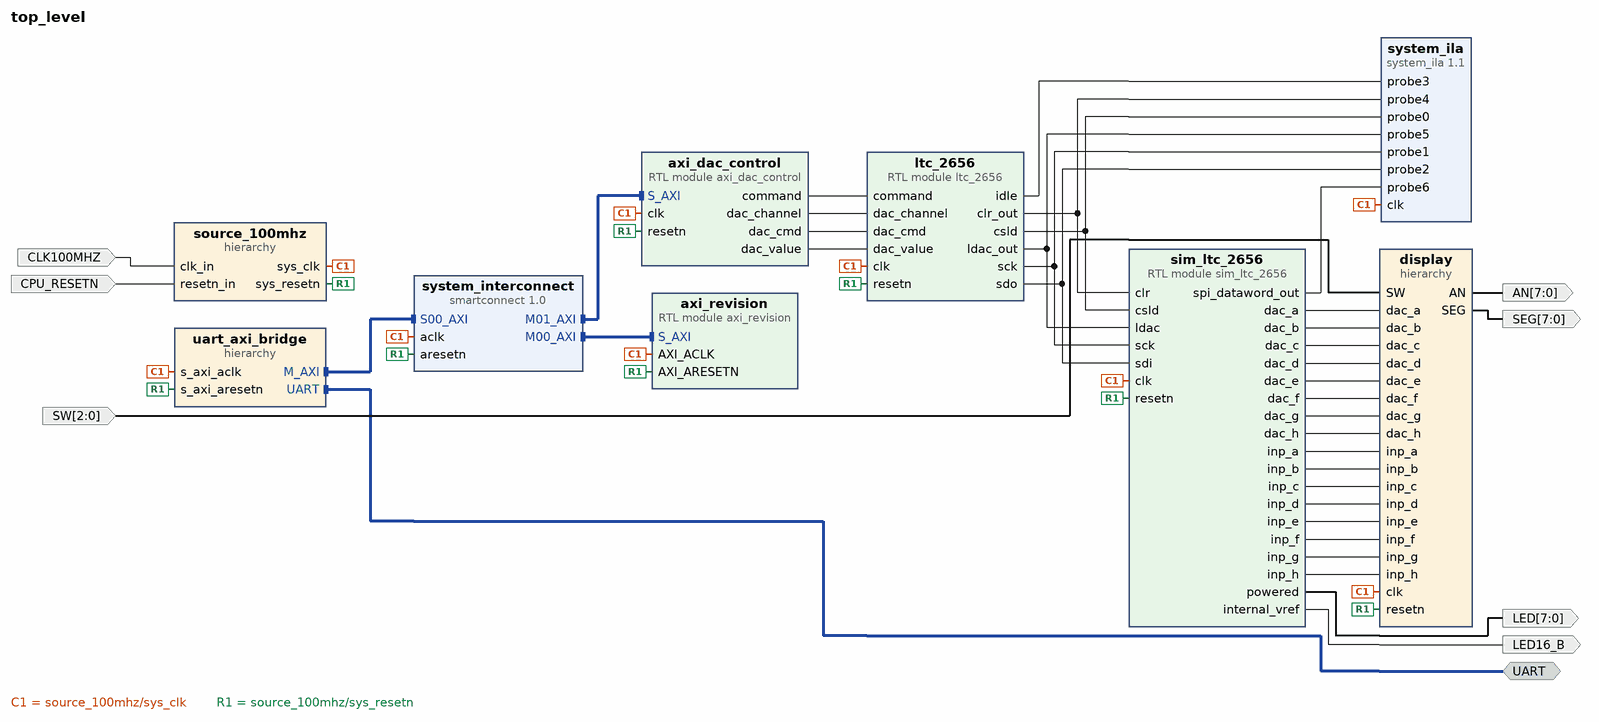
[diagram p0: block diagram of the top level]
# Vivado block design top_level, xc7a100tcsg324-1, Vivado 2021.1
create_bd_design top_level

create_bd_intf_port -mode Master -vlnv xilinx.com:interface:uart_rtl:1.0 UART
create_bd_port -dir I -type clk CLK100MHZ
create_bd_port -dir I -type rst CPU_RESETN
create_bd_port -dir O -from 7 -to 0 LED
create_bd_port -dir I -from 2 -to 0 SW
create_bd_port -dir O -from 7 -to 0 AN
create_bd_port -dir O -from 7 -to 0 SEG
create_bd_port -dir O LED16_B

create_bd_cell -type hier source_100mhz
create_bd_cell -type hier uart_axi_bridge
create_bd_cell -type ip -vlnv xilinx.com:ip:smartconnect:1.0 system_interconnect
set_property -dict {CONFIG.NUM_MI 2 CONFIG.NUM_SI 1} [get_bd_cells system_interconnect]
create_bd_cell -type ip -vlnv xilinx.com:ip:system_ila:1.1 system_ila
set_property -dict {CONFIG.C_MON_TYPE NATIVE CONFIG.C_NUM_OF_PROBES 7} [get_bd_cells system_ila]
create_bd_cell -type module -reference sim_ltc_2656 sim_ltc_2656
set_property -dict {CONFIG.UNPOWERED_DAC_VALUE 0xDEAD} [get_bd_cells sim_ltc_2656]
create_bd_cell -type module -reference axi_revision axi_revision
create_bd_cell -type hier display
create_bd_cell -type module -reference axi_dac_control axi_dac_control
create_bd_cell -type module -reference ltc_2656 ltc_2656

# ---- hierarchy /source_100mhz ----
current_bd_instance /source_100mhz
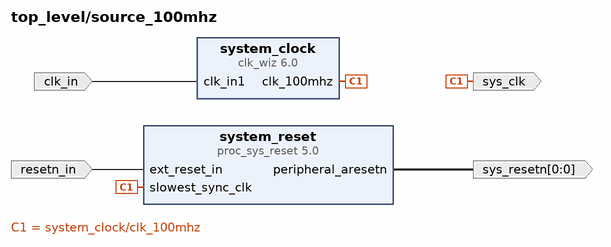
[diagram p1: block diagram inside /source_100mhz]
create_bd_pin -dir I -type clk clk_in
create_bd_pin -dir I -type rst resetn_in
create_bd_pin -dir O -type clk sys_clk
create_bd_pin -dir O -from 0 -to 0 sys_resetn

create_bd_cell -type ip -vlnv xilinx.com:ip:clk_wiz:6.0 system_clock
set_property -dict {CONFIG.CLK_OUT1_PORT clk_100mhz CONFIG.USE_LOCKED false CONFIG.USE_RESET false} [get_bd_cells system_clock]
create_bd_cell -type ip -vlnv xilinx.com:ip:proc_sys_reset:5.0 system_reset

# ---- hierarchy /uart_axi_bridge ----
current_bd_instance /uart_axi_bridge
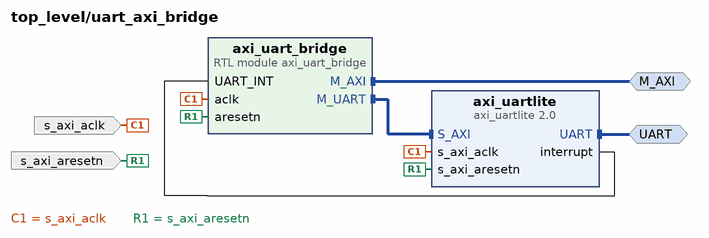
[diagram p2: block diagram inside /uart_axi_bridge]
create_bd_intf_pin -mode Master -vlnv xilinx.com:interface:uart_rtl:1.0 UART
create_bd_intf_pin -mode Master -vlnv xilinx.com:interface:aximm_rtl:1.0 M_AXI
create_bd_pin -dir I -type clk s_axi_aclk
create_bd_pin -dir I -type rst s_axi_aresetn

create_bd_cell -type module -reference axi_uart_bridge axi_uart_bridge
create_bd_cell -type ip -vlnv xilinx.com:ip:axi_uartlite:2.0 axi_uartlite
set_property -dict {CONFIG.C_BAUDRATE 115200} [get_bd_cells axi_uartlite]

# ---- hierarchy /display ----
current_bd_instance /display
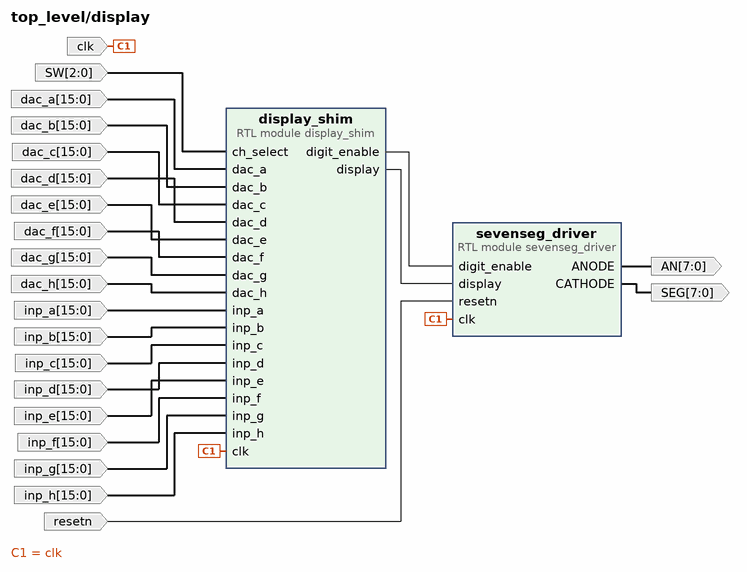
[diagram p3: block diagram inside /display]
create_bd_pin -dir I -type clk clk
create_bd_pin -dir I -from 15 -to 0 dac_a
create_bd_pin -dir I -from 15 -to 0 dac_b
create_bd_pin -dir I -from 15 -to 0 dac_c
create_bd_pin -dir I -from 15 -to 0 dac_d
create_bd_pin -dir I -from 15 -to 0 dac_e
create_bd_pin -dir I -from 15 -to 0 dac_f
create_bd_pin -dir I -from 15 -to 0 dac_g
create_bd_pin -dir I -from 15 -to 0 dac_h
create_bd_pin -dir I -from 15 -to 0 inp_a
create_bd_pin -dir I -from 15 -to 0 inp_b
create_bd_pin -dir I -from 15 -to 0 inp_c
create_bd_pin -dir I -from 15 -to 0 inp_d
create_bd_pin -dir I -from 15 -to 0 inp_e
create_bd_pin -dir I -from 15 -to 0 inp_f
create_bd_pin -dir I -from 15 -to 0 inp_g
create_bd_pin -dir I -from 15 -to 0 inp_h
create_bd_pin -dir I -from 2 -to 0 SW
create_bd_pin -dir I -type rst resetn
create_bd_pin -dir O -from 7 -to 0 AN
create_bd_pin -dir O -from 7 -to 0 SEG

create_bd_cell -type module -reference display_shim display_shim
create_bd_cell -type module -reference sevenseg_driver sevenseg_driver

# ---- connections ----

current_bd_instance /source_100mhz
connect_bd_net -net clk_in1_0_1 [get_bd_pins clk_in] [get_bd_pins system_clock/clk_in1]
connect_bd_net -net ext_reset_in_0_1 [get_bd_pins resetn_in] [get_bd_pins system_reset/ext_reset_in]
connect_bd_net [get_bd_pins system_clock/clk_100mhz] [get_bd_pins sys_clk] [get_bd_pins system_reset/slowest_sync_clk]
connect_bd_net [get_bd_pins system_reset/peripheral_aresetn] [get_bd_pins sys_resetn]

current_bd_instance /uart_axi_bridge
connect_bd_intf_net [get_bd_intf_pins M_AXI] [get_bd_intf_pins axi_uart_bridge/M_AXI]
connect_bd_intf_net [get_bd_intf_pins axi_uart_bridge/M_UART] [get_bd_intf_pins axi_uartlite/S_AXI]
connect_bd_intf_net [get_bd_intf_pins UART] [get_bd_intf_pins axi_uartlite/UART]
connect_bd_net [get_bd_pins axi_uartlite/interrupt] [get_bd_pins axi_uart_bridge/UART_INT]
connect_bd_net -net source_100mhz_sys_clk [get_bd_pins s_axi_aclk] [get_bd_pins axi_uartlite/s_axi_aclk] [get_bd_pins axi_uart_bridge/aclk]
connect_bd_net -net source_100mhz_sys_resetn [get_bd_pins s_axi_aresetn] \
  [get_bd_pins axi_uartlite/s_axi_aresetn] [get_bd_pins axi_uart_bridge/aresetn]

current_bd_instance /display
connect_bd_net -net ch_select_0_1 [get_bd_pins SW] [get_bd_pins display_shim/ch_select]
connect_bd_net [get_bd_pins display_shim/digit_enable] [get_bd_pins sevenseg_driver/digit_enable]
connect_bd_net [get_bd_pins display_shim/display] [get_bd_pins sevenseg_driver/display]
connect_bd_net [get_bd_pins sevenseg_driver/ANODE] [get_bd_pins AN]
connect_bd_net [get_bd_pins sevenseg_driver/CATHODE] [get_bd_pins SEG]
connect_bd_net -net sim_ltc_2656_dac_a [get_bd_pins dac_a] [get_bd_pins display_shim/dac_a]
connect_bd_net -net sim_ltc_2656_dac_b [get_bd_pins dac_b] [get_bd_pins display_shim/dac_b]
connect_bd_net -net sim_ltc_2656_dac_c [get_bd_pins dac_c] [get_bd_pins display_shim/dac_c]
connect_bd_net -net sim_ltc_2656_dac_d [get_bd_pins dac_d] [get_bd_pins display_shim/dac_d]
connect_bd_net -net sim_ltc_2656_dac_e [get_bd_pins dac_e] [get_bd_pins display_shim/dac_e]
connect_bd_net -net sim_ltc_2656_dac_f [get_bd_pins dac_f] [get_bd_pins display_shim/dac_f]
connect_bd_net -net sim_ltc_2656_dac_g [get_bd_pins dac_g] [get_bd_pins display_shim/dac_g]
connect_bd_net -net sim_ltc_2656_dac_h [get_bd_pins dac_h] [get_bd_pins display_shim/dac_h]
connect_bd_net -net sim_ltc_2656_inp_a [get_bd_pins inp_a] [get_bd_pins display_shim/inp_a]
connect_bd_net -net sim_ltc_2656_inp_b [get_bd_pins inp_b] [get_bd_pins display_shim/inp_b]
connect_bd_net -net sim_ltc_2656_inp_c [get_bd_pins inp_c] [get_bd_pins display_shim/inp_c]
connect_bd_net -net sim_ltc_2656_inp_d [get_bd_pins inp_d] [get_bd_pins display_shim/inp_d]
connect_bd_net -net sim_ltc_2656_inp_e [get_bd_pins inp_e] [get_bd_pins display_shim/inp_e]
connect_bd_net -net sim_ltc_2656_inp_f [get_bd_pins inp_f] [get_bd_pins display_shim/inp_f]
connect_bd_net -net sim_ltc_2656_inp_g [get_bd_pins inp_g] [get_bd_pins display_shim/inp_g]
connect_bd_net -net sim_ltc_2656_inp_h [get_bd_pins inp_h] [get_bd_pins display_shim/inp_h]
connect_bd_net -net source_100mhz_sys_clk [get_bd_pins clk] [get_bd_pins sevenseg_driver/clk] [get_bd_pins display_shim/clk]
connect_bd_net -net source_100mhz_sys_resetn [get_bd_pins resetn] [get_bd_pins sevenseg_driver/resetn]

current_bd_instance /
connect_bd_intf_net -intf_net axi_uartlite_UART [get_bd_intf_ports UART] [get_bd_intf_pins uart_axi_bridge/UART]
connect_bd_intf_net [get_bd_intf_pins system_interconnect/M00_AXI] [get_bd_intf_pins axi_revision/S_AXI]
connect_bd_intf_net [get_bd_intf_pins axi_dac_control/S_AXI] [get_bd_intf_pins system_interconnect/M01_AXI]
connect_bd_intf_net [get_bd_intf_pins uart_axi_bridge/M_AXI] [get_bd_intf_pins system_interconnect/S00_AXI]
connect_bd_net [get_bd_pins axi_dac_control/command] [get_bd_pins ltc_2656/command]
connect_bd_net [get_bd_pins axi_dac_control/dac_channel] [get_bd_pins ltc_2656/dac_channel]
connect_bd_net [get_bd_pins axi_dac_control/dac_cmd] [get_bd_pins ltc_2656/dac_cmd]
connect_bd_net [get_bd_pins axi_dac_control/dac_value] [get_bd_pins ltc_2656/dac_value]
connect_bd_net -net ch_select_0_1 [get_bd_ports SW] [get_bd_pins display/SW]
connect_bd_net -net clk_in1_0_1 [get_bd_ports CLK100MHZ] [get_bd_pins source_100mhz/clk_in]
connect_bd_net -net ext_reset_in_0_1 [get_bd_ports CPU_RESETN] [get_bd_pins source_100mhz/resetn_in]
connect_bd_net [get_bd_pins ltc_2656/clr_out] [get_bd_pins system_ila/probe4] [get_bd_pins sim_ltc_2656/clr]
connect_bd_net [get_bd_pins ltc_2656/csld] [get_bd_pins system_ila/probe0] [get_bd_pins sim_ltc_2656/csld]
connect_bd_net [get_bd_pins ltc_2656/idle] [get_bd_pins system_ila/probe3]
connect_bd_net [get_bd_pins ltc_2656/ldac_out] [get_bd_pins system_ila/probe5] [get_bd_pins sim_ltc_2656/ldac]
connect_bd_net [get_bd_pins ltc_2656/sck] [get_bd_pins system_ila/probe1] [get_bd_pins sim_ltc_2656/sck]
connect_bd_net [get_bd_pins ltc_2656/sdo] [get_bd_pins system_ila/probe2] [get_bd_pins sim_ltc_2656/sdi]
connect_bd_net -net sevenseg_driver_ANODE [get_bd_pins display/AN] [get_bd_ports AN]
connect_bd_net -net sevenseg_driver_CATHODE [get_bd_pins display/SEG] [get_bd_ports SEG]
connect_bd_net [get_bd_pins sim_ltc_2656/dac_a] [get_bd_pins display/dac_a]
connect_bd_net [get_bd_pins sim_ltc_2656/dac_b] [get_bd_pins display/dac_b]
connect_bd_net [get_bd_pins sim_ltc_2656/dac_c] [get_bd_pins display/dac_c]
connect_bd_net [get_bd_pins sim_ltc_2656/dac_d] [get_bd_pins display/dac_d]
connect_bd_net [get_bd_pins sim_ltc_2656/dac_e] [get_bd_pins display/dac_e]
connect_bd_net [get_bd_pins sim_ltc_2656/dac_f] [get_bd_pins display/dac_f]
connect_bd_net [get_bd_pins sim_ltc_2656/dac_g] [get_bd_pins display/dac_g]
connect_bd_net [get_bd_pins sim_ltc_2656/dac_h] [get_bd_pins display/dac_h]
connect_bd_net [get_bd_pins sim_ltc_2656/inp_a] [get_bd_pins display/inp_a]
connect_bd_net [get_bd_pins sim_ltc_2656/inp_b] [get_bd_pins display/inp_b]
connect_bd_net [get_bd_pins sim_ltc_2656/inp_c] [get_bd_pins display/inp_c]
connect_bd_net [get_bd_pins sim_ltc_2656/inp_d] [get_bd_pins display/inp_d]
connect_bd_net [get_bd_pins sim_ltc_2656/inp_e] [get_bd_pins display/inp_e]
connect_bd_net [get_bd_pins sim_ltc_2656/inp_f] [get_bd_pins display/inp_f]
connect_bd_net [get_bd_pins sim_ltc_2656/inp_g] [get_bd_pins display/inp_g]
connect_bd_net [get_bd_pins sim_ltc_2656/inp_h] [get_bd_pins display/inp_h]
connect_bd_net [get_bd_pins sim_ltc_2656/internal_vref] [get_bd_ports LED16_B]
connect_bd_net [get_bd_pins sim_ltc_2656/powered] [get_bd_ports LED]
connect_bd_net [get_bd_pins sim_ltc_2656/spi_dataword_out] [get_bd_pins system_ila/probe6]
connect_bd_net [get_bd_pins source_100mhz/sys_clk] \
  [get_bd_pins uart_axi_bridge/s_axi_aclk] [get_bd_pins system_interconnect/aclk] [get_bd_pins system_ila/clk] \
  [get_bd_pins sim_ltc_2656/clk] [get_bd_pins axi_revision/AXI_ACLK] [get_bd_pins display/clk] \
  [get_bd_pins axi_dac_control/clk] [get_bd_pins ltc_2656/clk]
connect_bd_net [get_bd_pins source_100mhz/sys_resetn] \
  [get_bd_pins uart_axi_bridge/s_axi_aresetn] [get_bd_pins system_interconnect/aresetn] [get_bd_pins sim_ltc_2656/resetn] \
  [get_bd_pins axi_revision/AXI_ARESETN] [get_bd_pins display/resetn] [get_bd_pins axi_dac_control/resetn] \
  [get_bd_pins ltc_2656/resetn]

# ---- address map ----
assign_bd_address -offset 0x0000000000000000 -range 256 -target_address_space [get_bd_addr_spaces uart_axi_bridge/axi_uart_bridge/M_AXI] [get_bd_addr_segs axi_revision/S_AXI/reg0]
assign_bd_address -offset 0x0000000000001000 -range 256 -target_address_space [get_bd_addr_spaces uart_axi_bridge/axi_uart_bridge/M_AXI] [get_bd_addr_segs axi_dac_control/S_AXI/reg0]
assign_bd_address -offset 0x40600000 -range 64K -target_address_space [get_bd_addr_spaces uart_axi_bridge/axi_uart_bridge/M_UART] [get_bd_addr_segs uart_axi_bridge/axi_uartlite/S_AXI/Reg]

validate_bd_design
save_bd_design
